# Altium project micro rgb matrix.PrjPcb
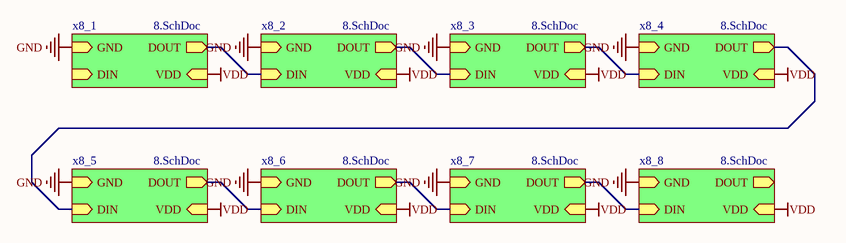
[diagram p0: main.SchDoc]
2 sheets, 64 parts. Net scope: strictly hierarchical (ports join the sheet entries above them; power ports are local).
Board file: main.PcbDoc
Sheets:
  main.SchDoc
    x8_1 = 8.SchDoc
    x8_2 = 8.SchDoc
    x8_3 = 8.SchDoc
    x8_4 = 8.SchDoc
    x8_5 = 8.SchDoc
    x8_6 = 8.SchDoc
    x8_7 = 8.SchDoc
    x8_8 = 8.SchDoc

## Sheet main.SchDoc
size A; SheetNumber: 1; SheetTotal: 2

### Sub-sheets
x8_1 = 8.SchDoc: DIN (in), VDD, DOUT (out), GND
x8_2 = 8.SchDoc: DIN (in), VDD, DOUT (out), GND
x8_3 = 8.SchDoc: DIN (in), VDD, DOUT (out), GND
x8_4 = 8.SchDoc: DIN (in), VDD, DOUT (out), GND
x8_5 = 8.SchDoc: DIN (in), VDD, DOUT (out), GND
x8_6 = 8.SchDoc: DIN (in), VDD, DOUT (out), GND
x8_7 = 8.SchDoc: DIN (in), VDD, DOUT (out), GND
x8_8 = 8.SchDoc: DIN (in), VDD, DOUT (out), GND

### Nets
GND: sheet x8_1/GND, sheet x8_2/GND, sheet x8_3/GND, sheet x8_4/GND, sheet x8_5/GND, sheet x8_6/GND, sheet x8_7/GND, sheet x8_8/GND
VDD: sheet x8_1/VDD, sheet x8_2/VDD, sheet x8_3/VDD, sheet x8_4/VDD, sheet x8_5/VDD, sheet x8_6/VDD, sheet x8_7/VDD, sheet x8_8/VDD
DIN: sheet x8_1/DOUT, sheet x8_2/DIN
DIN: sheet x8_2/DOUT, sheet x8_3/DIN  [a separate net that carries the same name]
DIN: sheet x8_3/DOUT, sheet x8_4/DIN  [a separate net that carries the same name]
DIN: sheet x8_4/DOUT, sheet x8_5/DIN  [a separate net that carries the same name]
DIN: sheet x8_5/DOUT, sheet x8_6/DIN  [a separate net that carries the same name]
DIN: sheet x8_6/DOUT, sheet x8_7/DIN  [a separate net that carries the same name]
DIN: sheet x8_7/DOUT, sheet x8_8/DIN  [a separate net that carries the same name]

## Sheet 8.SchDoc
size A4; SheetNumber: 2; SheetTotal: 2
Used 8 times, as channels x8_1, x8_2, x8_3, x8_4, x8_5, x8_6, x8_7, x8_8. Parts and nets are listed once, with the designators drawn on the sheet.
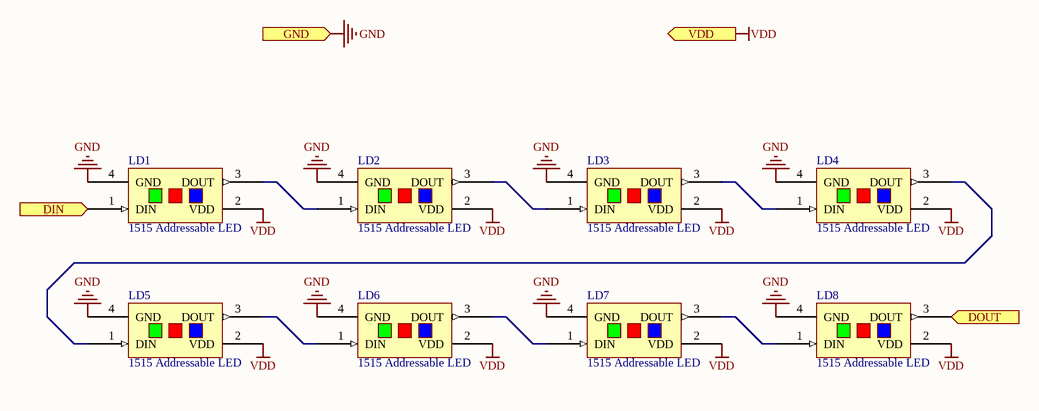
[diagram p1: 8.SchDoc]

### Parts
LD1  1515 Addressable LED  [SK6805-EC 15 DENSE]
LD2  1515 Addressable LED  [SK6805-EC 15 DENSE]
LD3  1515 Addressable LED  [SK6805-EC 15 DENSE]
LD4  1515 Addressable LED  [SK6805-EC 15 DENSE]
LD5  1515 Addressable LED  [SK6805-EC 15 DENSE]
LD6  1515 Addressable LED  [SK6805-EC 15 DENSE]
LD7  1515 Addressable LED  [SK6805-EC 15 DENSE]
LD8  1515 Addressable LED  [SK6805-EC 15 DENSE]

### Ports
DIN (in), DOUT (out), GND, VDD

### Nets
GND: LD1.4(GND) LD2.4(GND) LD3.4(GND) LD4.4(GND) LD5.4(GND) LD6.4(GND) LD7.4(GND) LD8.4(GND) ; port GND
VDD: LD1.2(VDD) LD2.2(VDD) LD3.2(VDD) LD4.2(VDD) LD5.2(VDD) LD6.2(VDD) LD7.2(VDD) LD8.2(VDD) ; port VDD
DIN: LD1.1(DIN) ; port DIN
DOUT: LD8.3(DOUT) ; port DOUT
NetLD1_3: LD1.3(DOUT) LD2.1(DIN)
NetLD2_3: LD2.3(DOUT) LD3.1(DIN)
NetLD3_3: LD3.3(DOUT) LD4.1(DIN)
NetLD4_3: LD4.3(DOUT) LD5.1(DIN)
NetLD5_3: LD5.3(DOUT) LD6.1(DIN)
NetLD6_3: LD6.3(DOUT) LD7.1(DIN)
NetLD7_3: LD7.3(DOUT) LD8.1(DIN)

### Channels
x8_1: designators end in _x8_1; ports DIN=DIN_x8_1 DOUT=DIN GND=GND VDD=VDD
x8_2: designators end in _x8_2; ports DIN=DIN DOUT=DIN GND=GND VDD=VDD
x8_3: designators end in _x8_3; ports DIN=DIN DOUT=DIN GND=GND VDD=VDD
x8_4: designators end in _x8_4; ports DIN=DIN DOUT=DIN GND=GND VDD=VDD
x8_5: designators end in _x8_5; ports DIN=DIN DOUT=DIN GND=GND VDD=VDD
x8_6: designators end in _x8_6; ports DIN=DIN DOUT=DIN GND=GND VDD=VDD
x8_7: designators end in _x8_7; ports DIN=DIN DOUT=DIN GND=GND VDD=VDD
x8_8: designators end in _x8_8; ports DIN=DIN DOUT=DOUT_x8_8 GND=GND VDD=VDD

### Library data of the parts
LD1-LD8 = SK6805-EC 15

## Nets that join several sheets
GND: x8_1 (8 pins), x8_2 (8 pins), x8_3 (8 pins), x8_4 (8 pins), x8_5 (8 pins), x8_6 (8 pins), x8_7 (8 pins), x8_8 (8 pins)
VDD: x8_1 (8 pins), x8_2 (8 pins), x8_3 (8 pins), x8_4 (8 pins), x8_5 (8 pins), x8_6 (8 pins), x8_7 (8 pins), x8_8 (8 pins)
DIN: x8_1 (LD8_x8_1.3), x8_2 (LD1_x8_2.1)
DIN: x8_2 (LD8_x8_2.3), x8_3 (LD1_x8_3.1)
DIN: x8_3 (LD8_x8_3.3), x8_4 (LD1_x8_4.1)
DIN: x8_4 (LD8_x8_4.3), x8_5 (LD1_x8_5.1)
DIN: x8_5 (LD8_x8_5.3), x8_6 (LD1_x8_6.1)
DIN: x8_6 (LD8_x8_6.3), x8_7 (LD1_x8_7.1)
DIN: x8_7 (LD8_x8_7.3), x8_8 (LD1_x8_8.1)